# EAGLE schematic armwiz-board (EAGLE 6.5.0)
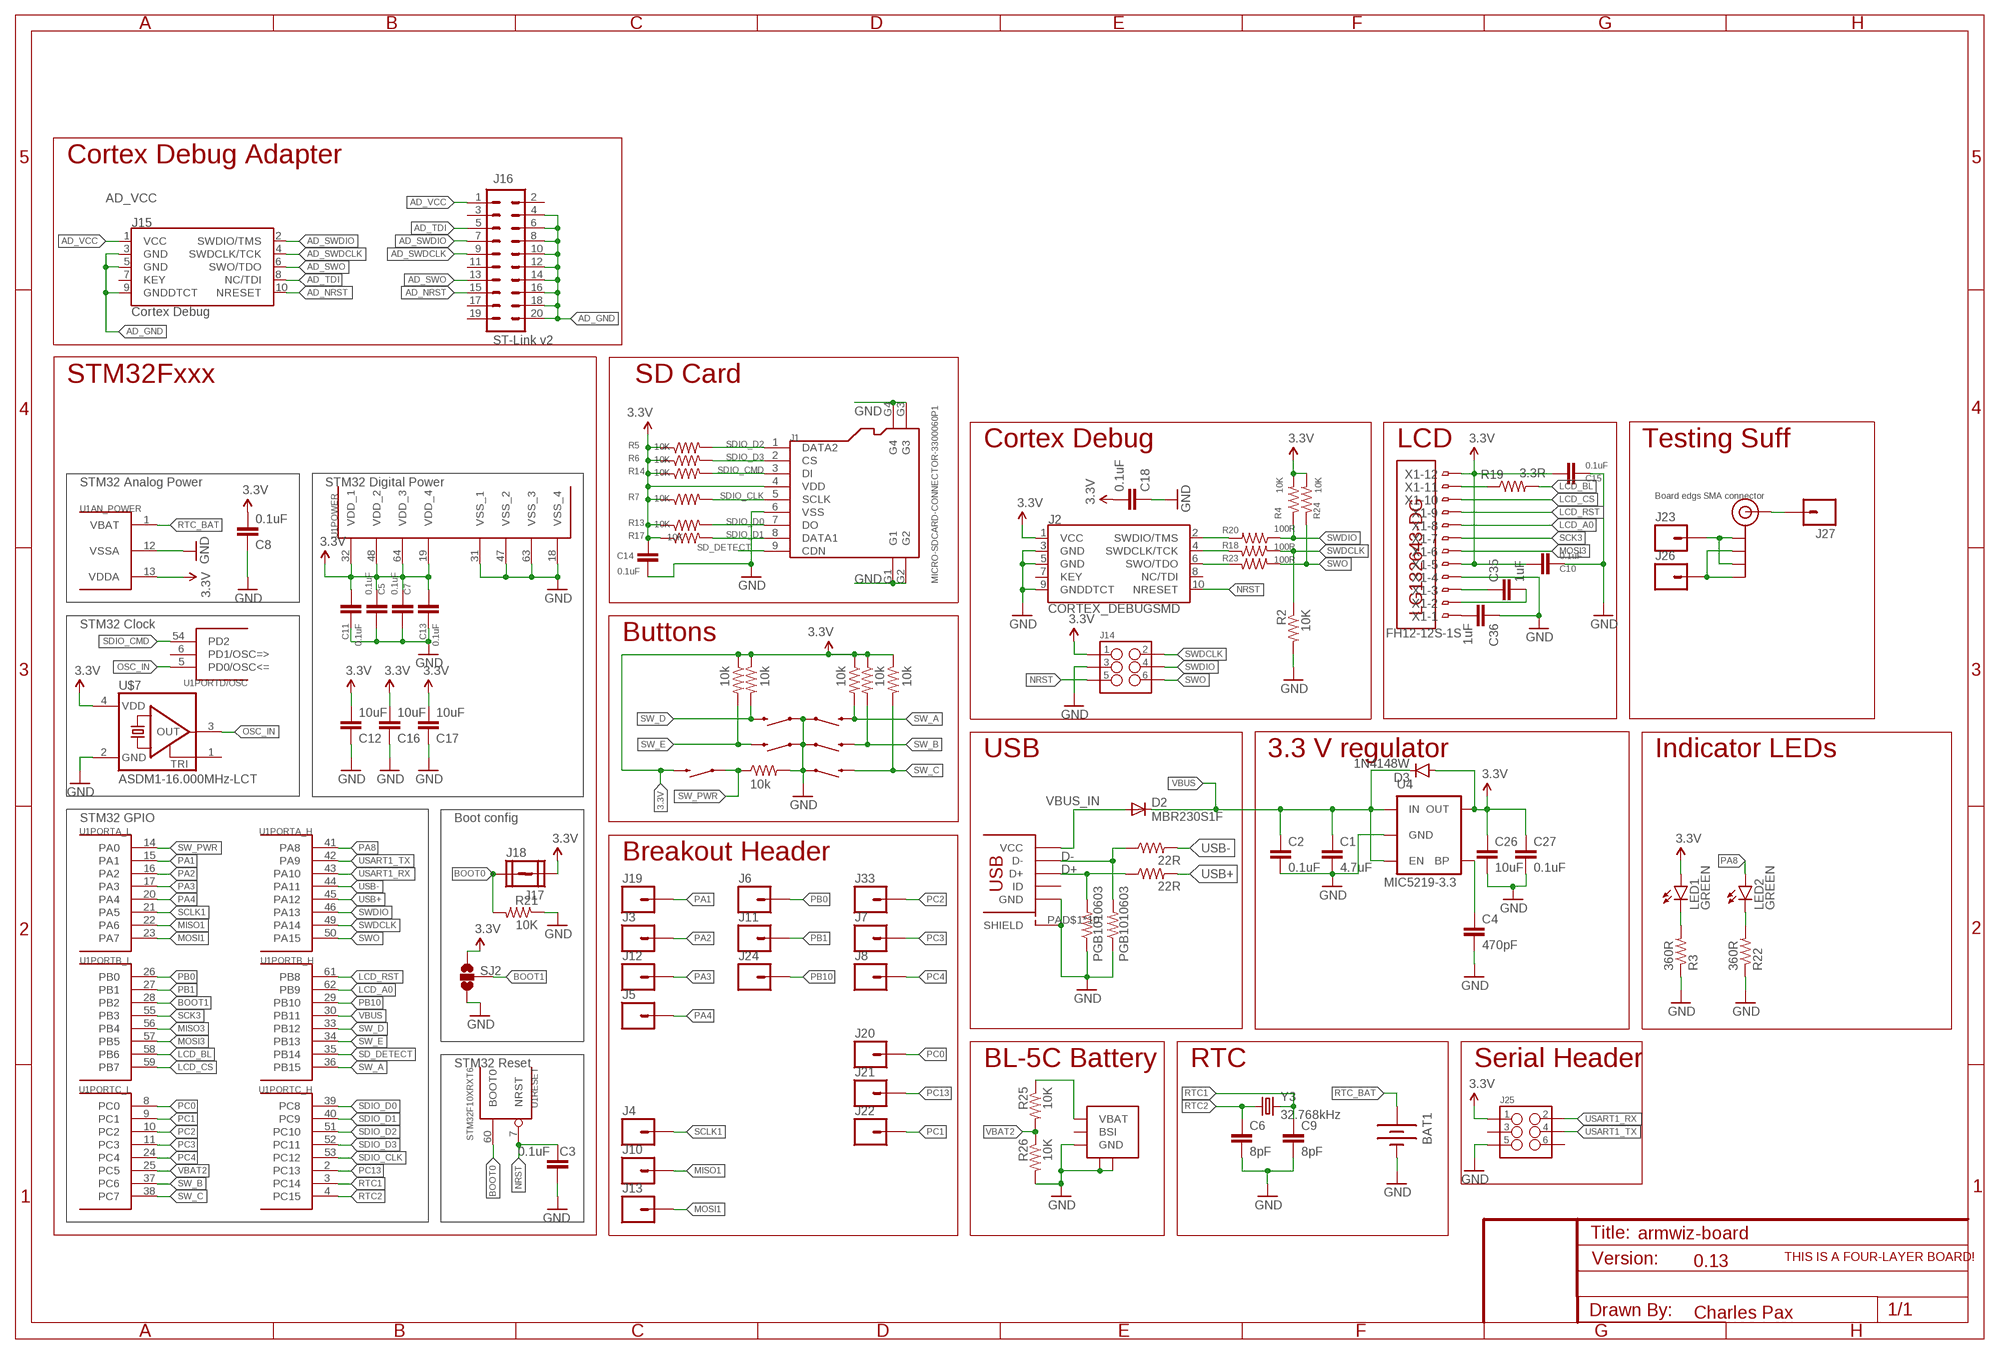
[diagram p0: schematic, sheet 1]

## Parts
BAT1  BATTERY12MM  [BATTCON_12MM]
C1  4.7uF  C-EUC0402K  [C0402K]
C2  0.1uF  C-EUC0402K  [C0402K]
C3  0.1uF  C-EUC0402K  [C0402K]
C4  470pF  C-EUC0402K  [C0402K]
C5  0.1uF  C-EUC0402K  [C0402K]
C6  8pF  C-EUC0402K  [C0402K]
C7  0.1uF  C-EUC0402K  [C0402K]
C8  0.1uF  C-EUC0402K  [C0402K]
C9  8pF  C-EUC0402K  [C0402K]
C10  0.1uF  C-EUC0402K  [C0402K]
C11  0.1uF  C-EUC0402K  [C0402K]
C12  10uF  C-EUC0402K  [C0402K]
C13  0.1uF  C-EUC0402K  [C0402K]
C14  0.1uF  C-EUC0402K  [C0402K]
C15  0.1uF  C-EUC0402K  [C0402K]
C16  10uF  C-EUC0402K  [C0402K]
C17  10uF  C-EUC0402K  [C0402K]
C18  0.1uF  C-EUC0402K  [C0402K]
C26  10uF  C-EUC0402K  [C0402K]
C27  0.1uF  C-EUC0402K  [C0402K]
C35  1uF  C-EUC0402K  [C0402K]
C36  1uF  C-EUC0402K  [C0402K]
D2  MBR230S1F  SPARKFUN-DISCRETESEMI_DIODESOD123SOD123  [SOD123]
D3  1N4148W  DIODESOD123  [SOD-123]
J1  MICRO-SDCARD-CONNECTOR-3300060P1  [9P-SMD-W-RING]
J2  CORTEX_DEBUGSMD  [SAMTECH_FTSH-105-01]
J3  M01PTH  [1X01]
J4  M01PTH  [1X01]
J5  M01PTH  [1X01]
J6  M01PTH  [1X01]
J7  M01PTH  [1X01]
J8  M01PTH  [1X01]
J10  M01PTH  [1X01]
J11  M01PTH  [1X01]
J12  M01PTH  [1X01]
J13  M01PTH  [1X01]
J14  M03X2PAX  [CONNECTORS_2X3_SMT_POSTS_T400]
J15  Cortex Debug  CORTEX_DEBUGSMD  [SAMTECH_FTSH-105-01]
J16  ST-Link v2  M10X2  [2X10]
J17  M01NOSILK-KIT  [1X01NS-KIT]
J18  M01NOSILK-KIT  [1X01NS-KIT]
J19  M01PTH  [1X01]
J20  M01PTH  [1X01]
J21  M01PTH  [1X01]
J22  M01PTH  [1X01]
J23  M01PTH  [1X01]
J24  M01PTH  [1X01]
J25  M03X2PAX  [CONNECTORS_2X3_SMT_POSTS_T400]
J26  M01PTH  [1X01]
J27  M01PTH  [1X01]
J33  M01PTH  [1X01]
J$1  SMA_EDGE  [SMA-EDGE]
LED1  GREEN  LED0603  [LED-0603]
LED2  GREEN  LED0603  [LED-0603]
R1  10k  R-US_R0402  [R0402]
R2  10K  R-US_R0402  [R0402]
R3  360R  R-US_R0402  [R0402]
R4  10K  R-US_R0402  [R0402]
R5  10K  R-US_R0402  [R0402]
R6  10K  R-US_R0402  [R0402]
R7  10K  R-US_R0402  [R0402]
R8  10k  R-US_R0402  [R0402]
R9  22R  R-US_R0402  [R0402]
R10  22R  R-US_R0402  [R0402]
R11  10k  R-US_R0402  [R0402]
R12  10k  R-US_R0402  [R0402]
R13  10K  R-US_R0402  [R0402]
R14  10K  R-US_R0402  [R0402]
R15  10k  R-US_R0402  [R0402]
R16  10k  R-US_R0402  [R0402]
R17  10K  R-US_R0402  [R0402]
R18  100R  R-US_R0402  [R0402]
R19  3.3R  R-US_R0402  [R0402]
R20  100R  R-US_R0402  [R0402]
R21  10K  R-US_R0402  [R0402]
R22  360R  R-US_R0402  [R0402]
R23  100R  R-US_R0402  [R0402]
R24  10K  R-US_R0402  [R0402]
R25  10K  R-US_R0402  [R0402]
R26  10K  R-US_R0402  [R0402]
S1  SWITCH-MOMENTARY-2SMD  [TACTILE_SWITCH_SMD]
S2  SWITCH-MOMENTARY-2SMD  [TACTILE_SWITCH_SMD]
S3  SWITCH-MOMENTARY-2SMD  [TACTILE_SWITCH_SMD]
S4  SWITCH-MOMENTARY-2SMD  [TACTILE_SWITCH_SMD]
S5  SWITCH-MOMENTARY-2SMD  [TACTILE_SWITCH_SMD]
S6  SWITCH-MOMENTARY-2SMD  [TACTILE_SWITCH_SMD]
SJ2  SOLDERJUMPER_2WAYS  [SJ_3]
U1  STM32F10XRXT6  [TQFP64]
U4  MIC5219-3.3V  V_REG_LDOSMD  [SOT23-5]
U$1  USB_MICROSMT+THRUHULE  [USB_MICRO_THRUHOLE]
U$2  FOUR_LAYER_WARNING  [FOUR_LAYER_WARNING]
U$3  BL-5C-CONNECTOR  [BL-5C-CONNECTOR]
U$5  LG132643-DG  [LG132643-DG]
U$7  ASDM1-16.000MHz-LCT  ASE  [ASE]
X1  FH12-12S-1S  [FH12-12S-1SH]
Y3  32.768kHz  CRYSTAL3.2X1.5MM  [CRYSTAL-SMD-3.2X1.5MM]
Z1  PGB1010603  SPARKFUN-RESISTORS_RESISTOR0603-RES  [SPARKFUN-RESISTORS_0603-RES]
Z2  PGB1010603  SPARKFUN-RESISTORS_RESISTOR0603-RES  [SPARKFUN-RESISTORS_0603-RES]

## Nets
3.3V: C5.1 C7.1 C8.2 C10.2 C11.2 C12.2 C13.2 C14.2 C15.2 C16.2 C17.2 C18.2 C26.1 C27.1 D3.A J1.4(VDD) J2.1(VCC) J14.1 J18.1 J25.1 LED1.A R4.2 R5.1 R6.1 R7.1 R8.1 R11.1 R12.1 R13.1 R14.1 R15.1 R16.1 R17.1 R24.2 S6.3 SJ2.3 U1.13(AN_POWER:VDDA) U1.19(POWER:VDD_4) U1.32(POWER:VDD_1) U1.48(POWER:VDD_2) U1.64(POWER:VDD_3) U4.5(OUT) U$7.4(VDD) X1.5 X1.12
AD_GND: J15.3(GND) J15.5(GND) J15.9(GNDDTCT) J16.4 J16.6 J16.8 J16.10 J16.12 J16.14 J16.16 J16.18 J16.20
AD_NRST: J15.10(NRESET) J16.15
AD_SWDCLK: J15.4(SWDCLK/TCK) J16.9
AD_SWDIO: J15.2(SWDIO/TMS) J16.7
AD_SWO: J15.6(SWO/TDO) J16.13
AD_TDI: J15.8(NC/TDI) J16.5
AD_VCC: J15.1(VCC) J16.1
BOOT0: J17.1 R21.2 U1.60(RESET:BOOT0)
BOOT1: SJ2.2 U1.28(PORTB_L:PB2)
D+: R9.1 U$1.PIN$3(D+) Z1.2
D-: R10.1 U$1.PIN$2(D-) Z2.2
GND: BAT1.GND(-) C1.2 C2.2 C3.2 C4.2 C5.2 C6.2 C7.2 C8.1 C9.2 C10.1 C11.1 C12.1 C13.1 C14.1 C15.1 C16.1 C17.1 C18.1 C26.2 C27.2 C36.1 J1.6(VSS) J1.G1 J1.G2 J1.G3 J1.G4 J2.3(GND) J2.5(GND) J2.9(GNDDTCT) J14.3 J25.5 R1.2 R2.2 R3.1 R21.1 R22.1 R26.2 S1.1 S2.1 S3.1 S4.1 S5.1 SJ2.1 U1.12(AN_POWER:VSSA) U1.18(POWER:VSS_4) U1.31(POWER:VSS_1) U1.47(POWER:VSS_2) U1.63(POWER:VSS_3) U4.2(GND) U$1.PAD$1(SHIELD) U$1.PAD$2(SHIELD) U$1.PAD$3(SHIELD) U$1.PAD$4(SHIELD) U$1.PAD$5(SHIELD) U$1.PAD$6(SHIELD) U$1.PAD$7(SHIELD) U$1.PAD$8(SHIELD) U$1.PAD$9(SHIELD) U$1.PAD$10(SHIELD) U$1.PIN$5(GND) U$3.P$3(GND) U$3.P$4 U$3.P$5 U$7.2(GND) X1.4 Z1.1 Z2.1
LCD_A0: U1.62(PORTB_H:PB9) X1.8
LCD_BL: R19.2 U1.58(PORTB_L:PB6)
LCD_CS: U1.59(PORTB_L:PB7) X1.10
LCD_RST: U1.61(PORTB_H:PB8) X1.9
MISO1: J10.1 U1.22(PORTA_L:PA6)
MISO3: U1.56(PORTB_L:PB4)
MOSI1: J13.1 U1.23(PORTA_L:PA7)
MOSI3: U1.57(PORTB_L:PB5) X1.6
N$1: C4.1 U4.4(BP)
N$4: R19.1 X1.11
N$5: J2.4(SWDCLK/TCK) R18.2
N$7: LED1.C R3.2
N$11: LED2.C R22.2
N$12: J2.6(SWO/TDO) R23.2
N$13: J2.2(SWDIO/TMS) R20.2
N$14: J26.1 J$1.GND@1(GND) J$1.GND@3(GND)
N$15: J23.1 J$1.GND@0(GND) J$1.GND@2(GND)
N$16: R25.1 U$3.P$1(VBAT)
N$20: J27.1 J$1.SIG(SIGNAL)
N$37: C35.1 X1.3
N$38: C35.2 X1.2
N$39: C36.2 X1.1
NRST: C3.1 J2.10(NRESET) J14.5 U1.7(RESET:NRST)
OSC_IN: U1.5(PORTD/OSC:PD0/OSC<=) U$7.3(OUT)
PA1: J19.1 U1.15(PORTA_L:PA1)
PA2: J3.1 U1.16(PORTA_L:PA2)
PA3: J12.1 U1.17(PORTA_L:PA3)
PA4: J5.1 U1.20(PORTA_L:PA4)
PA8: LED2.A U1.41(PORTA_H:PA8)
PB0: J6.1 U1.26(PORTB_L:PB0)
PB1: J11.1 U1.27(PORTB_L:PB1)
PB10: J24.1 U1.29(PORTB_H:PB10)
PC0: J20.1 U1.8(PORTC_L:PC0)
PC1: J22.1 U1.9(PORTC_L:PC1)
PC2: J33.1 U1.10(PORTC_L:PC2)
PC3: J7.1 U1.11(PORTC_L:PC3)
PC4: J8.1 U1.24(PORTC_L:PC4)
PC13: J21.1 U1.2(PORTC_H:PC13)
RTC1: C9.1 U1.3(PORTC_H:PC14) Y3.P$2
RTC2: C6.1 U1.4(PORTC_H:PC15) Y3.P$1
RTC_BAT [RTC battery]: BAT1.PWR@1(+) U1.1(AN_POWER:VBAT)
SCK3: U1.55(PORTB_L:PB3) X1.7
SCLK1: J4.1 U1.21(PORTA_L:PA5)
SD_DETECT: J1.9(CDN) U1.35(PORTB_H:PB14)
SDIO_CLK: J1.5(SCLK) R7.2 U1.53(PORTC_H:PC12)
SDIO_CMD: J1.3(DI) R14.2 U1.54(PORTD/OSC:PD2)
SDIO_D0: J1.7(DO) R13.2 U1.39(PORTC_H:PC8)
SDIO_D1: J1.8(DATA1) R17.2 U1.40(PORTC_H:PC9)
SDIO_D2: J1.1(DATA2) R5.2 U1.51(PORTC_H:PC10)
SDIO_D3: J1.2(CS) R6.2 U1.52(PORTC_H:PC11)
SW_A: R8.2 S3.3 U1.36(PORTB_H:PB15)
SW_B: R11.2 S2.3 U1.37(PORTC_L:PC6)
SW_C: R12.2 S1.3 U1.38(PORTC_L:PC7)
SW_D: R15.2 S4.3 U1.33(PORTB_H:PB12)
SW_E: R16.2 S5.3 U1.34(PORTB_H:PB13)
SW_PWR: R1.1 S6.1 U1.14(PORTA_L:PA0)
SWDCLK: J14.2 R2.1 R18.1 U1.49(PORTA_H:PA14)
SWDIO: J14.4 R4.1 R20.1 U1.46(PORTA_H:PA13)
SWO: J14.6 R23.1 R24.1 U1.50(PORTA_H:PA15)
USART1_RX: J25.2 U1.43(PORTA_H:PA10)
USART1_TX: J25.4 U1.42(PORTA_H:PA9)
USB+: R9.2 U1.45(PORTA_H:PA12)
USB-: R10.2 U1.44(PORTA_H:PA11)
VBAT2: R25.2 R26.1 U1.25(PORTC_L:PC5)
VBUS [3.3V power]: C1.1 C2.1 D2.C D3.C U1.30(PORTB_H:PB11) U4.1(IN) U4.3(EN)
VBUS_IN [3.3V power]: D2.A U$1.PIN$1(VCC)
Unconnected: J2.7(KEY) J2.8(NC/TDI) J15.7(KEY) J16.2 J16.3 J16.11 J16.17 J16.19 J25.3 J25.6 U1.6(PORTD/OSC:PD1/OSC=>) U$1.PIN$4(ID) U$3.P$2(BSI) U$7.1(TRI)

## Notes on the sheet
- Cortex Debug Adapter
- STM32Fxxx | SD Card
- Cortex Debug | LCD | Testing Suff
- STM32 Analog Power | STM32 Digital Power
- Board edgs SMA connector
- STM32 Clock
- Buttons
- USB | 3.3 V regulator | Indicator LEDs
- STM32 GPIO | Boot config
- Breakout Header
- MIC5219-3.3
- STM32 Reset | BL-5C Battery | RTC | Serial Header
- 0.13
- Charles Pax

## Library data of the parts
BAT1 = PaxInstruments-Electromechanical:BATTERY: Battery Holders Various common sizes : AA, AAA, 20mm coin cell and 12mm coin cell. 20MM_4LEGS, BATT-10373; MF: Keystone Electronics; MPN: 3000TR
C1-C18 C26 C27 C35 C36 = resistor:C-EU: CAPACITOR, European symbol
D2 = PaxInstrument-T400:SPARKFUN-DISCRETESEMI_DIODE: Diode These are standard reverse protection diodes and small signal diodes. SMA package can handle up to about 1A. SOD-323 can handle about 200mA. What the SOD-323 package when ordering, there are some mfgs out there that are 5-pin packages.; MF: DIODES INC; MPN: MBR230S1F-7
D3 = SparkFun-DiscreteSemi:DIODE: Diode These are standard reverse protection diodes and small signal diodes. SMA package can handle up to about 1A. SOD-323 can handle about 200mA. What the SOD-323 package when ordering, there are some mfgs out there that are 5-pin packages.
J1 = PaxInstrument-T400:MICRO-SDCARD-CONNECTOR: Micro SD Card; MF: SUNTECH; MPN: ST-TF-003A
J2 J15 = SparkFun-Connectors:CORTEX_DEBUG: Cortex Debug Connector Datasheet <http://infocenter.arm.com/help/topic/com.arm.doc.faqs/attached/13634/cortex_debug_connectors.pdf>
J3-J8 J10-J13 J17-J24 J26 J27 J33 = SparkFun-Connectors:M01: Header 1 Standard 1-pin 0.1" header. Use with straight break away headers (SKU : PRT-00116), right angle break away headers (PRT-00553), swiss pins (PRT-00743), machine pins (PRT-00117), and female headers (PRT-00115). SMTSO-256-ET is a "flush mount" nut for a 4-40 screw. The older package used to be too tight, and did not allow it to sit properly thru the drill hit. The latest (0.165DIA) fits nice and snug.
J14 J25 = PaxInstruments-Connectors:M03X2: 2x3 .1" header. Shrouded, with keying- CONN-10681 SMT- CONN-11415 Pogo pins- HW-11044; MF: FCI; MPN: 95278-101A06LF
J16 = SparkFun-Connectors:M10X2: This was SPECIALLY designed to be used with our Graphic LCD Backpack. Be sure you want to use this! It is not only staggered on each line of header holes, but IT IS ALSO offset of the center point of the top and bottom lines by 5 mil. This causes the headers to lock into place on the "standard" footprint on the LCD screen. The extra squares on the tdocu layer are there simply to reference other pins (if you were to actually populate a longer header than ten long - this is what we do with the backpacks).
J$1 = SparkFun-Connectors:SMA_EDGE: SMA Antenna Connector End launch SMA connector. The paste layer has been removed so that the connector can be hand soldered onto the board after reflow.
LED1 LED2 = SparkFun-LED:LED: LEDs Standard schematic elements and footprints for 5mm, 3mm, 1206, and 0603 sized LEDs. 5mm - Spark Fun Electronics SKU : COM-00529 (and others)
R1 R8 R11 R12 R15 R16 = resistor:R-US_: RESISTOR, American symbol; POPULATE: DNP
R2-R7 R9 R10 R13 R14 R17-R26 = resistor:R-US_: RESISTOR, American symbol
S1-S6 = SparkFun-Electromechanical:SWITCH-MOMENTARY-2: Various NO switches- pushbuttons, reed, etc; MF: C&K Components; MPN: RS-187R05A2-DS MT RT
SJ2 = SparkFun-Retired:SOLDERJUMPER_2WAY: Solder Jumper 2 way solder jumper
U1 = stm32:STM32F10XRXT6: STM32F101/103 64pin LQFP
U4 = SparkFun:V_REG_LDO: Voltage Regulator LDO Standard 150mA LDO voltage regulator in SOT-23 layout. Micrel part MIC5205. BP (by-pass) pin is used to lower output noise with 470pF cap.; MF: Micrel; MPN: MIC5219-3.3YM5 TR
U$1 = blinkinlabs:USB_MICRO; MF: FCI; MPN: 10118194-0001LF
U$2 = SparkFun-Aesthetics:FOUR_LAYER_WARNING: Warning text which will appear on both the schematic and the board file, notifying viewers that the design is a four-layer PCB.
U$3 = PaxInstruments-Connectors:BL-5C-CONNECTOR; MPN: BC-4-3P (77H)
U$5 = charlespax:LG132643-DG; MPN: LG132643-DW
U$7 = crystal:ASE: 3.3Vdc CMOS SMD CRYSTAL CLOCK OSCILLATOR SOurce: www.abracon.com; OC_FARNELL: unknown; OC_NEWARK: unknown
X1 = PaxInstrument-T400:FH12-12S-1S; MF: Hirose Connector; MPN: FH12-12S-1SH(55)
Y3 = SparkFun-FreqCtrl:CRYSTAL: Various standard crystals. Proven footprints.; PROD_ID: XTAL-13062
Z1 Z2 = PaxInstrument-T400:SPARKFUN-RESISTORS_RESISTOR: Resistor Basic schematic elements and footprints for 0603, 1206, and PTH resistors.; MF: Littelfuse; MPN: PGB1010603NRHF

## Net classes
0 Digital signal: width 0.075 mm, drill 0.2 mm, clearance 0.075 mm
1 3.3V power: width 0.075 mm, drill 0.2 mm, clearance 0.075 mm
2 RTC battery: width 0.075 mm, drill 0.2 mm, clearance 0.075 mm
3 5V power: width 0.075 mm, drill 0.2 mm, clearance 0.075 mm
4 Analog signal: width 0.075 mm, drill 0.2 mm, clearance 0.075 mm
5 Ground: width 0.075 mm, drill 0.2 mm, clearance 0.075 mm